# EAGLE design CPU-SOLDER_V2 (EAGLE 9.5.1)
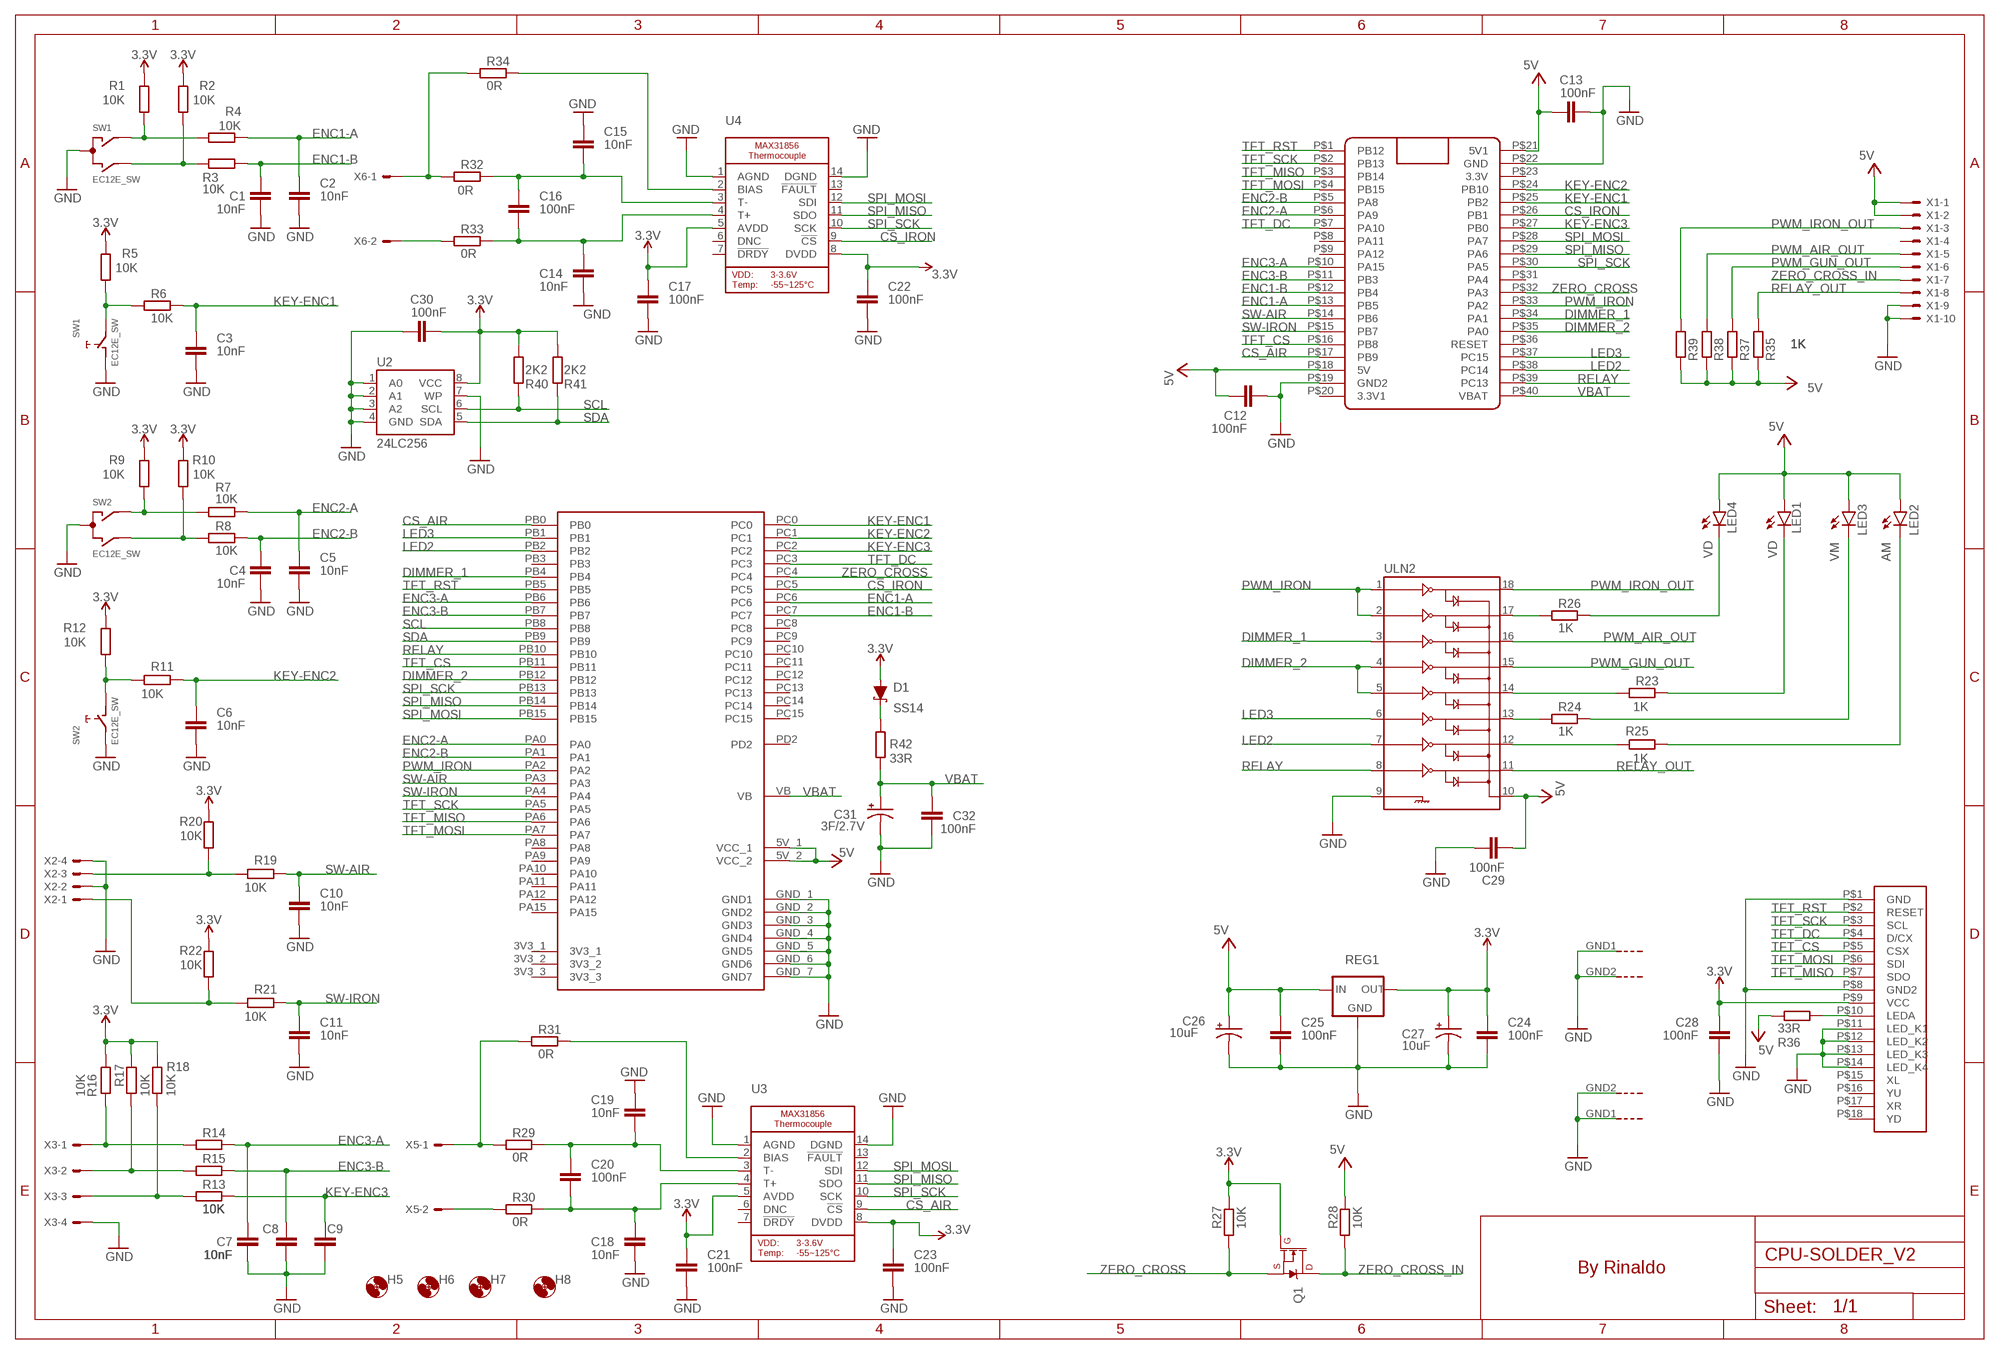
[diagram p0: schematic, sheet 1]

## Parts
C1  10nF  C-EUC0603  [C0603]
C2  10nF  C-EUC0603  [C0603]
C3  10nF  C-EUC0603  [C0603]
C4  10nF  C-EUC0603  [C0603]
C5  10nF  C-EUC0603  [C0603]
C6  10nF  C-EUC0603  [C0603]
C7  10nF  C-EUC0603  [C0603]
C8  10nF  C-EUC0603  [C0603]
C9  10nF  C-EUC0603  [C0603]
C10  10nF  C-EUC0603  [C0603]
C11  10nF  C-EUC0603  [C0603]
C12  100nF  C-EUC0603  [C0603]
C13  100nF  C-EUC0603  [C0603]
C14  10nF  C-EUC0603  [C0603]
C15  10nF  C-EUC0603  [C0603]
C16  100nF  C-EUC0603  [C0603]
C17  100nF  C-EUC0603  [C0603]
C18  10nF  C-EUC0603  [C0603]
C19  10nF  C-EUC0603  [C0603]
C20  100nF  C-EUC0603  [C0603]
C21  100nF  C-EUC0603  [C0603]
C22  100nF  C-EUC0603  [C0603]
C23  100nF  C-EUC0603  [C0603]
C24  100nF  C-EUC0603  [C0603]
C25  100nF  C-EUC0603  [C0603]
C26  10uF  10UF-POLAR-EIA3528-20V-10%(TANT)  [EIA3528]
C27  10uF  10UF-POLAR-EIA3528-20V-10%(TANT)  [EIA3528]
C28  100nF  C-EUC0603  [C0603]
C29  100nF  C-EUC0603  [C0603]
C30  100nF  C-EUC0603  [C0603]
C31  3F/2.7V  1F-2.7V(PTH)CPOL-RADIAL-1H-2.7V  [CPOL-RADIAL-1F-2.7V]
C32  100nF  C-EUC0603  [C0603]
D1  SS14  DIODE-SCHOTTKY-SS14  [SMA-DIODE]
H5  MOUNT-HOLE3.6  [3,6]
H6  MOUNT-HOLE3.6  [3,6]
H7  MOUNT-HOLE3.6  [3,6]
H8  MOUNT-HOLE3.6  [3,6]
LCD1  ILI9341-3.2  [ILI9341-3.2]
LED1  VD  LED5MM  [LED5MM]
LED2  AM  LED5MM  [LED5MM]
LED3  VM  LED5MM  [LED5MM]
LED4  VD  LED5MM  [LED5MM]
Q1  220mA/50V/3.5Ω  MOSFET-NCH-BSS138  [SOT23-3]
R1  10K  R-EU_R0603  [R0603]
R2  10K  R-EU_R0603  [R0603]
R3  10K  R-EU_R0603  [R0603]
R4  10K  R-EU_R0603  [R0603]
R5  10K  R-EU_R0603  [R0603]
R6  10K  R-EU_R0603  [R0603]
R7  10K  R-EU_R0603  [R0603]
R8  10K  R-EU_R0603  [R0603]
R9  10K  R-EU_R0603  [R0603]
R10  10K  R-EU_R0603  [R0603]
R11  10K  R-EU_R0603  [R0603]
R12  10K  R-EU_R0603  [R0603]
R13  10K  R-EU_R0603  [R0603]
R14  10K  R-EU_R0603  [R0603]
R15  10K  R-EU_R0603  [R0603]
R16  10K  R-EU_R0603  [R0603]
R17  10K  R-EU_R0603  [R0603]
R18  10K  R-EU_R0603  [R0603]
R19  10K  R-EU_R0603  [R0603]
R20  10K  R-EU_R0603  [R0603]
R21  10K  R-EU_R0603  [R0603]
R22  10K  R-EU_R0603  [R0603]
R23  1K  R-EU_R0603  [R0603]
R24  1K  R-EU_R0603  [R0603]
R25  1K  R-EU_R0603  [R0603]
R26  1K  R-EU_R0603  [R0603]
R27  10K  R-EU_R0603  [R0603]
R28  10K  R-EU_R0603  [R0603]
R29  0R  R-EU_R0603  [R0603]
R30  0R  R-EU_R0603  [R0603]
R31  0R  R-EU_R0603  [R0603]
R32  0R  R-EU_R0603  [R0603]
R33  0R  R-EU_R0603  [R0603]
R34  0R  R-EU_R0603  [R0603]
R35  1K  R-EU_R0603  [R0603]
R36  33R  R-EU_R2512  [R2512]
R37  1K  R-EU_R0603  [R0603]
R38  1K  R-EU_R0603  [R0603]
R39  1K  R-EU_R0603  [R0603]
R40  2K2  R-EU_R0603  [R0603]
R41  2K2  R-EU_R0603  [R0603]
R42  33R  R-EU_R2512  [R2512]
REG1  V_REG_LD1117VXXLD1117-SMD  [SOT223]
SW1  EC12E_SW  [ALPS_EC12E_SW]
SW2  EC12E_SW  [ALPS_EC12E_SW]
U1  STM32-F411  BLACK-PILL-STM32_BLACK_PILL  [BLACK-PILL-STM32_BLUE_PILL]
U2  24LC256  EEPROM-I2C256K  [SO08]
U3  MICROBUILDER_MAX31856  [MICROBUILDER_TSSOP14]
U4  MICROBUILDER_MAX31856  [MICROBUILDER_TSSOP14]
U5  F405_WEACT  [F405_WEACT]
ULN2  ULN2803SOICW  [SO18L]
X1  JST-XH-10-PIN-ROUND-PAD  [JST-XH-10-PACKAGE-ROUND-PAD]
X2  JST-XH-04-PIN-ROUND-PAD  [JST-XH-04-PACKAGE-ROUND-PAD]
X3  JST-XH-04-PIN-ROUND-PAD  [JST-XH-04-PACKAGE-ROUND-PAD]
X5  JST-XH-02-PIN-ROUND-PAD  [JST-XH-02-PACKAGE-ROUND-PAD]
X6  JST-XH-02-PIN-ROUND-PAD  [JST-XH-02-PACKAGE-ROUND-PAD]

## Nets
3.3V: C17.2 C21.2 C22.2 C23.2 C24.2 C27.A(+) C28.2 C30.1 D1.A LCD1.P$9(VCC) Q1.1(G) R1.2 R2.2 R5.2 R9.2 R10.2 R12.2 R16.2 R17.2 R18.2 R20.2 R22.2 R27.2 R40.1 R41.1 REG1.2(OUT) U2.8(VCC) U3.5(AVDD) U3.8(DVDD) U4.5(AVDD) U4.8(DVDD)
CS_AIR: U1.P$17(PB9) U3.9(!CS) U5.PB0
CS_IRON: U1.P$26(PB1) U4.9(!CS) U5.PC5
DIMMER_1: U1.P$34(PA1) U5.PB4 ULN2.3
DIMMER_2: U1.P$35(PA0) U5.PB12 ULN2.4 ULN2.5
ENC1-A: C2.1 R3.1 U1.P$13(PB5) U5.PC6
ENC1-B: C1.1 R4.2 U1.P$12(PB4) U5.PC7
ENC2-A: C5.1 R7.2 U1.P$6(PA9) U5.PA0
ENC2-B: C4.1 R8.2 U1.P$5(PA8) U5.PA1
ENC3-A: C7.1 R14.2 U1.P$10(PA15) U5.PB6
ENC3-B: C8.1 R15.2 U1.P$11(PB3) U5.PB7
GND: C1.2 C2.2 C3.2 C4.2 C5.2 C6.2 C7.2 C8.2 C9.2 C10.2 C11.2 C12.2 C13.2 C14.1 C15.2 C17.1 C18.1 C19.2 C21.1 C22.1 C23.1 C24.1 C25.1 C26.C(-) C27.C(-) C28.1 C29.2 C30.2 C31.- C32.2 LCD1.P$1(GND) LCD1.P$8(GND2) LCD1.P$11(LED_K1) LCD1.P$12(LED_K2) LCD1.P$13(LED_K3) LCD1.P$14(LED_K4) REG1.1(GND) SW1.C SW1.D SW1.GND1(G) SW1.GND2(G) SW2.C SW2.E SW2.GND1(G) SW2.GND2(G) U1.P$19(GND2) U1.P$22(GND) U2.1(A0) U2.2(A1) U2.3(A2) U2.4(GND) U2.7(WP) U3.1(AGND) U3.14(DGND) U4.1(AGND) U4.14(DGND) U5.GND_1(GND1) U5.GND_2(GND2) U5.GND_3(GND3) U5.GND_4(GND4) U5.GND_5(GND5) U5.GND_6(GND6) U5.GND_7(GND7) ULN2.9 X1.9 X1.10 X2.2 X2.4 X3.4
KEY-ENC1: C3.1 R6.1 U1.P$25(PB2) U5.PC0
KEY-ENC2: C6.1 R11.1 U1.P$24(PB10) U5.PC1
KEY-ENC3: C9.1 R13.2 U1.P$27(PB0) U5.PC2
LED2: U1.P$38(PC14) U5.PB2 ULN2.7
LED3: U1.P$37(PC15) U5.PB1 ULN2.6
N$1: R1.1 R3.2 SW1.A
N$2: R2.1 R4.1 SW1.B
N$3: R7.1 R9.1 SW2.A
N$4: R8.1 R10.1 SW2.B
N$5: R5.1 R6.2 SW1.E
N$6: R11.2 R12.1 SW2.D
N$7: R24.2 ULN2.13
N$8: R14.1 R16.1 X3.1
N$9: R15.1 R17.1 X3.2
N$10: R13.1 R18.1 X3.3
N$11: R25.1 ULN2.12
N$12: R23.2 ULN2.14
N$13: LED1.K(C) R23.1
N$14: R21.2 R22.1 X2.1
N$15: R19.2 R20.1 X2.3
N$16: LED3.K(C) R24.1
N$17: LED2.K(C) R25.2
N$18: R26.1 ULN2.17
N$19: LED4.K(C) R26.2
N$20: R29.2 R31.2 X5.1
N$21: R32.2 R34.2 X6.1
N$23: LCD1.P$10(LEDA) R36.2
N$24: D1.C R42.2
N$28: C15.1 C16.2 R32.1 U4.3(T-)
N$29: C14.2 C16.1 R33.1 U4.4(T+)
N$31: R33.2 X6.2
N$33: R34.1 U4.2(BIAS)
N$36: C19.1 C20.2 R29.1 U3.3(T-)
N$37: C18.2 C20.1 R30.1 U3.4(T+)
N$38: R30.2 X5.2
N$39: R31.1 U3.2(BIAS)
PWM_AIR_OUT: R38.1 ULN2.16 X1.5
PWM_GUN_OUT: R37.1 ULN2.15 X1.6
PWM_IRON: U1.P$33(PA2) U5.PA2 ULN2.1 ULN2.2
PWM_IRON_OUT: R39.1 ULN2.18 X1.3
RELAY: U1.P$39(PC13) U5.PB10 ULN2.8
RELAY_OUT: R35.1 ULN2.11 X1.8
SCL: R40.2 U2.6(SCL) U5.PB8
SDA: R41.2 U2.5(SDA) U5.PB9
SPI_MISO: U1.P$29(PA6) U3.11(SDO) U4.11(SDO) U5.PB14
SPI_MOSI: U1.P$28(PA7) U3.12(SDI) U4.12(SDI) U5.PB15
SPI_SCK: U1.P$30(PA5) U3.10(SCK) U4.10(SCK) U5.PB13
SW-AIR: C10.1 R19.1 U1.P$14(PB6) U5.PA3
SW-IRON: C11.1 R21.1 U1.P$15(PB7) U5.PA4
TFT_CS: LCD1.P$5(CSX) U1.P$16(PB8) U5.PB11
TFT_DC: LCD1.P$4(D/CX) U1.P$7(PA10) U5.PC3
TFT_MISO: LCD1.P$7(SDO) U1.P$3(PB14) U5.PA6
TFT_MOSI: LCD1.P$6(SDI) U1.P$4(PB15) U5.PA7
TFT_RST: LCD1.P$2(RESET) U1.P$1(PB12) U5.PB5
TFT_SCK: LCD1.P$3(SCL) U1.P$2(PB13) U5.PA5
VBAT: C31.+ C32.1 R42.1 U1.P$40(VBAT) U5.VB
VCC: C12.1 C13.1 C25.2 C26.A(+) C29.1 LED1.A LED2.A LED3.A LED4.A R28.2 R35.2 R36.1 R37.2 R38.2 R39.2 REG1.3(IN) U1.P$18(5V) U1.P$21(5V1) U5.5V_1(VCC_1) U5.5V_2(VCC_2) ULN2.10 X1.1 X1.2 ; supply symbol labelled 5V
ZERO_CROSS: Q1.2(S) R27.1 U1.P$32(PA3) U5.PC4
ZERO_CROSS_IN: Q1.3(D) R28.1 X1.7
Unconnected: LCD1.P$15(XL) LCD1.P$16(YU) LCD1.P$17(XR) LCD1.P$18(YD) U1.P$8(PA11) U1.P$9(PA12) U1.P$20(3.3V1) U1.P$23(3.3V) U1.P$31(PA4) U1.P$36(RESET) U3.6(DNC) U3.7(!DRDY) U3.13(!FAULT) U4.6(DNC) U4.7(!DRDY) U4.13(!FAULT) U5.3V3_1 U5.3V3_2 U5.3V3_3 U5.PA8 U5.PA9 U5.PA10 U5.PA11 U5.PA12 U5.PA15 U5.PB3 U5.PC8 U5.PC9 U5.PC10 U5.PC11 U5.PC12 U5.PC13 U5.PC14 U5.PC15 U5.PD2 X1.4

## Notes on the sheet
- By Rinaldo

## Library data of the parts
C1-C25 C28-C30 C32 = rcl:C-EU: CAPACITOR, European symbol; SPICEPREFIX: C
C26 C27 = SparkFun-Capacitors:10UF-POLAR: 10.0µF polarized capacitors A capacitor is a passive two-terminal electrical component used to store electrical energy temporarily in an electric field.; PROD_ID: CAP-08063
C31 = SparkFun-Capacitors:1F-2.7V(PTH): 1F 2.7V SuperCapacitor CAP-14696; PROD_ID: CAP-14696
D1 = SparkFun-DiscreteSemi:DIODE-SCHOTTKY: Schottky diode A Schottky diode is a semiconductor diode which has a low forward voltage drop and a very fast switching action.; PROD_ID: DIO-08053; VALUE: 1A/40V/500mV
H5-H8 = holes:MOUNT-HOLE: MOUNTING HOLE with drill center marker
LCD1 = ili9341:ILI9341-3.2
LED1-LED4 = led:LED: LED OSRAM: - CHIPLED LG R971, LG N971, LY N971, LG Q971, LY Q971, LO R971, LY R971 LH N974, LH R974 LS Q976, LO Q976, LY Q976 LO Q996 - Hyper CHIPLED LW Q18S LB Q993, LB Q99A, LB R99A - SideLED LS A670, LO A670, LY A670, LG A670, LP A670 LB A673, LV A673, LT A673, LW A673 LH A674 LY A675 LS A676, LA A676, LO A676, LY A676, LW A676 LS A679, LY A679, LG A679 - Hyper Micro SIDELED® LS Y876, LA Y876, LO Y876, LY Y876 LT Y87S - SmartLED LW L88C, LW L88S LB L89C, LB L89S, LG L890 LS L89K, LO L89K, LY L89K LS L896, LA L896, LO L896, LY L896 - TOPLED LS T670, LO T670, LY T670, LG T670, LP T670 LSG T670, LSP T670, LSY T670, LOP T670, LYG T670 LG T671, LOG T671, LSG T671 LB T673, LV T673, LT T673, LW T673 LH T674 LS T676, LA T676, LO T676, LY T676, LB T676, LH T676, LSB T676, LW T676 LB T67C, LV T67C, LT T67C, LS T67K, LO T67K, LY T67K, LW E67C LS E67B, LA E67B, LO E67B, LY E67B, LB E67C, LV E67C, LT E67C LW T67C LS T679, LY T679, LG T679 LS T770, LO T770, LY T770, LG T770, LP T770 LB T773, LV T773, LT T773, LW T773 LH T774 LS E675, LA E675, LY E675, LS T675 LS T776, LA T776, LO T776, LY T776, LB T776 LHGB T686 LT T68C, LB T68C - Hyper Mini TOPLED® LB M676 - Mini TOPLED Santana® LG M470 LS M47K, LO M47K, LY M47K Source: http://www.osram.convergy.de LUXEON: - LUMILED® LXK2-PW12-R00, LXK2-PW12-S00, LXK2-PW14-U00, LXK2-PW14-V00 LXK2-PM12-R00, LXK2-PM12-S00, LXK2-PM14-U00 LXK2-PE12-Q00, LXK2-PE12-R00, LXK2-PE12-S00, LXK2-PE14-T00, LXK2-PE14-U00 LXK2-PB12-K00, LXK2-PB12-L00, LXK2-PB12-M00, LXK2-PB14-N00, LXK2-PB14-P00, LXK2-PB14-Q00 LXK2-PR12-L00, LXK2-PR12-M00, LXK2-PR14-Q00, LXK2-PR14-R00 LXK2-PD12-Q00, LXK2-PD12-R00, LXK2-PD12-S00 LXK2-PH12-R00, LXK2-PH12-S00 LXK2-PL12-P00, LXK2-PL12-Q00, LXK2-PL12-R00 Source: www.luxeon.com KINGBRIGHT: KA-3528ASYC Source: www.kingbright.com
Q1 = SparkFun-DiscreteSemi:MOSFET-NCH: N-channel MOSFETs Voltage controlled devices that allow control of high current outputs. SparkFun Products: SparkFun OpenScale <https://www.sparkfun.com/products/13261> SparkFun Digital Sandbox <https://www.sparkfun.com/products/12651> SparkFun Monster Moto Shield <https://www.sparkfun.com/products/10182> SparkFun MOSFET Power Controller <https://www.sparkfun.com/products/11214>; PROD_ID: TRANS-00830
R1-R42 = rcl:R-EU_: RESISTOR, European symbol; SPICEPREFIX: R
REG1 = SparkFun-IC-Power:V_REG_LD1117VXX: LD1117VXX voltage regulator. We carry the 3.3V version (COM-00526) in TO-220 package.; PROD_ID: VREG-13917
SW1 SW2 = switch-alps:EC12E_SW: ALPS rotary Encoder EC12E series with switch; MPN: EC12E2424407; OC_FARNELL: 1520813; OC_NEWARK: 74M1068
U1 = Mini Black Pill grblHAL v1:BLACK-PILL-STM32_BLACK_PILL
U2 = SparkFun-IC-Memory:EEPROM-I2C: I2C EEPROMs, 24LC256 and others 24LC256 Series 256 kb I2C 2 Wire (32 k x 8 Bit) 2.5 V Serial EEPROM SMD - SOIC-8 Datasheet SparkFun Products SparkFun UDB5 - PIC UAV Development Board <https://www.sparkfun.com/products/11703> (GPS-11703); PROD_ID: IC-09714
U3 U4 = Adafruit MAX31856:MICROBUILDER_MAX31856: MAX31856 - Thermocouple Sensor ADC
U5 = WeACT:F405_WEACT: F405_WEACT
ULN2 = SparkFun-IC-Special-Function:ULN2803: Darlington Driver(IC-07959, low stock) ULN2803 Darlington array. 500mA max per channel, 8-channel package. Spark Fun Electronics SKU : COM-00312
X1 = Rembrandt Electronics - JST XH Connectors v1-0:JST-XH-10-PIN: JST XH Connector 2 Pin Wire to board connector. Pitch: 2,54 mm, (0.100") Number of pins: 10 Created by Rembrandt Electronics www.rembrandtelectronics.com
X2 X3 = Rembrandt Electronics - JST XH Connectors v1-0:JST-XH-04-PIN: JST XH Connector 2 Pin Wire to board connector. Pitch: 2,54 mm, (0.100") Number of pins: 4 Created by Rembrandt Electronics www.rembrandtelectronics.com
X5 X6 = Rembrandt Electronics - JST XH Connectors v1-0:JST-XH-02-PIN: JST XH Connector 2 Pin Wire to board connector. Pitch: 2,54 mm, (0.100") Number of pins: 2 Created by Rembrandt Electronics www.rembrandtelectronics.com

## Board
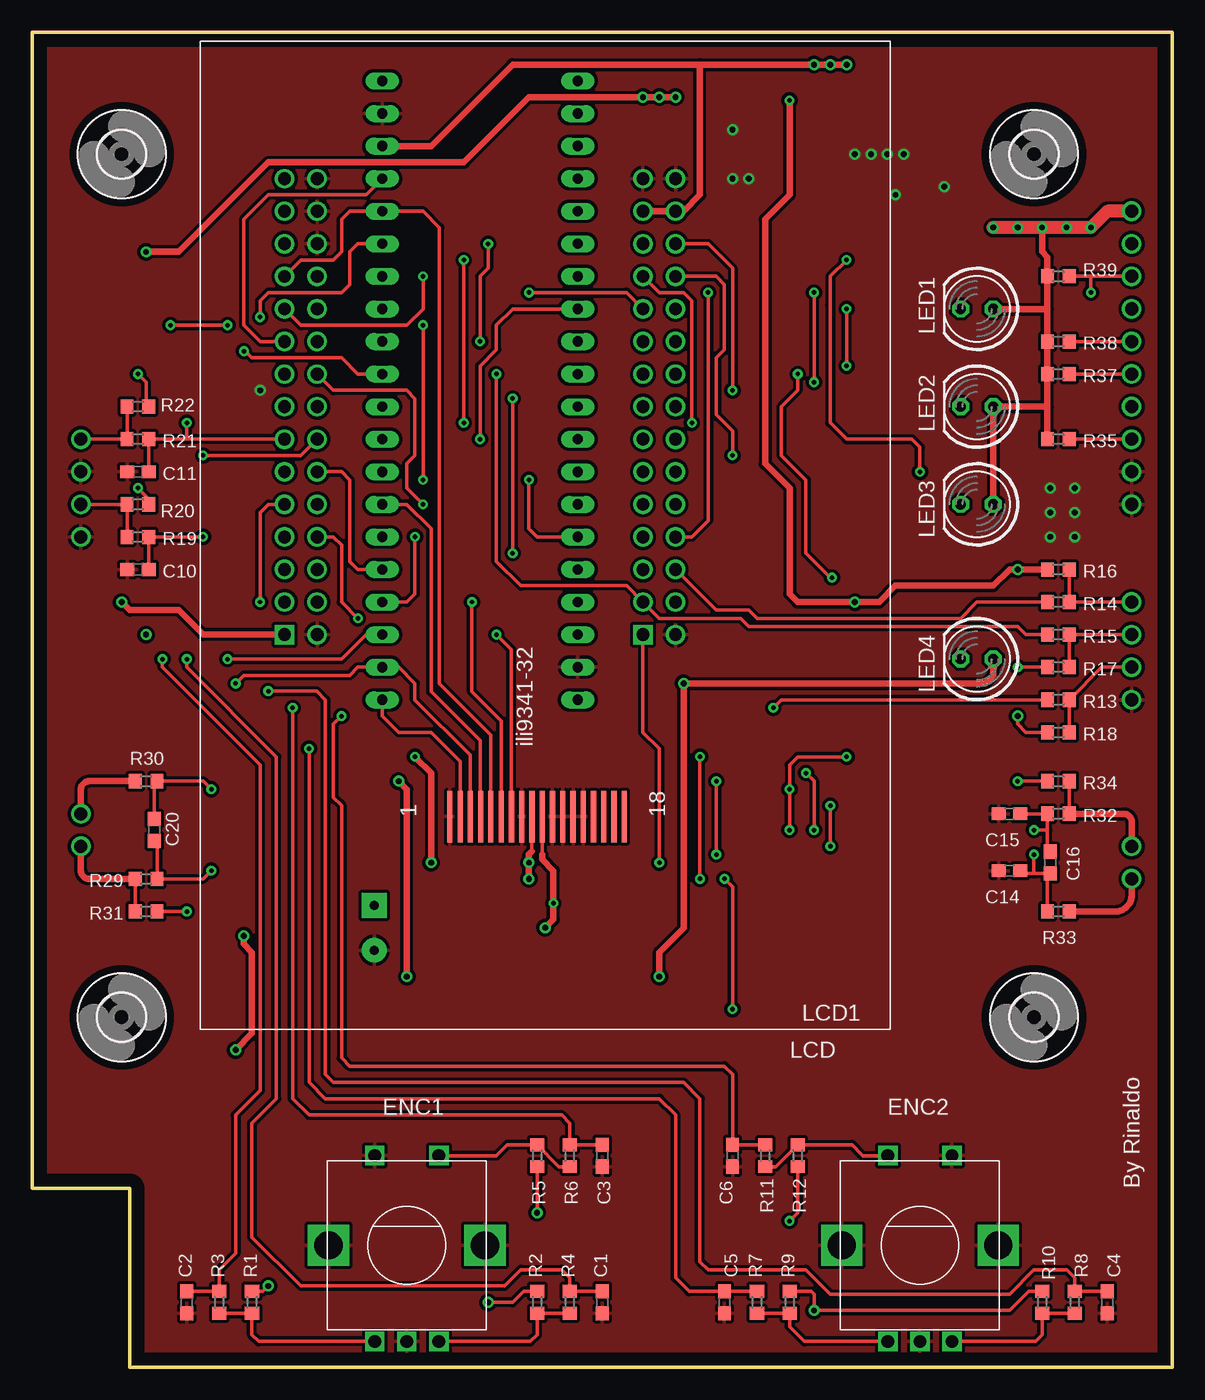
[diagram p1: board, top side]
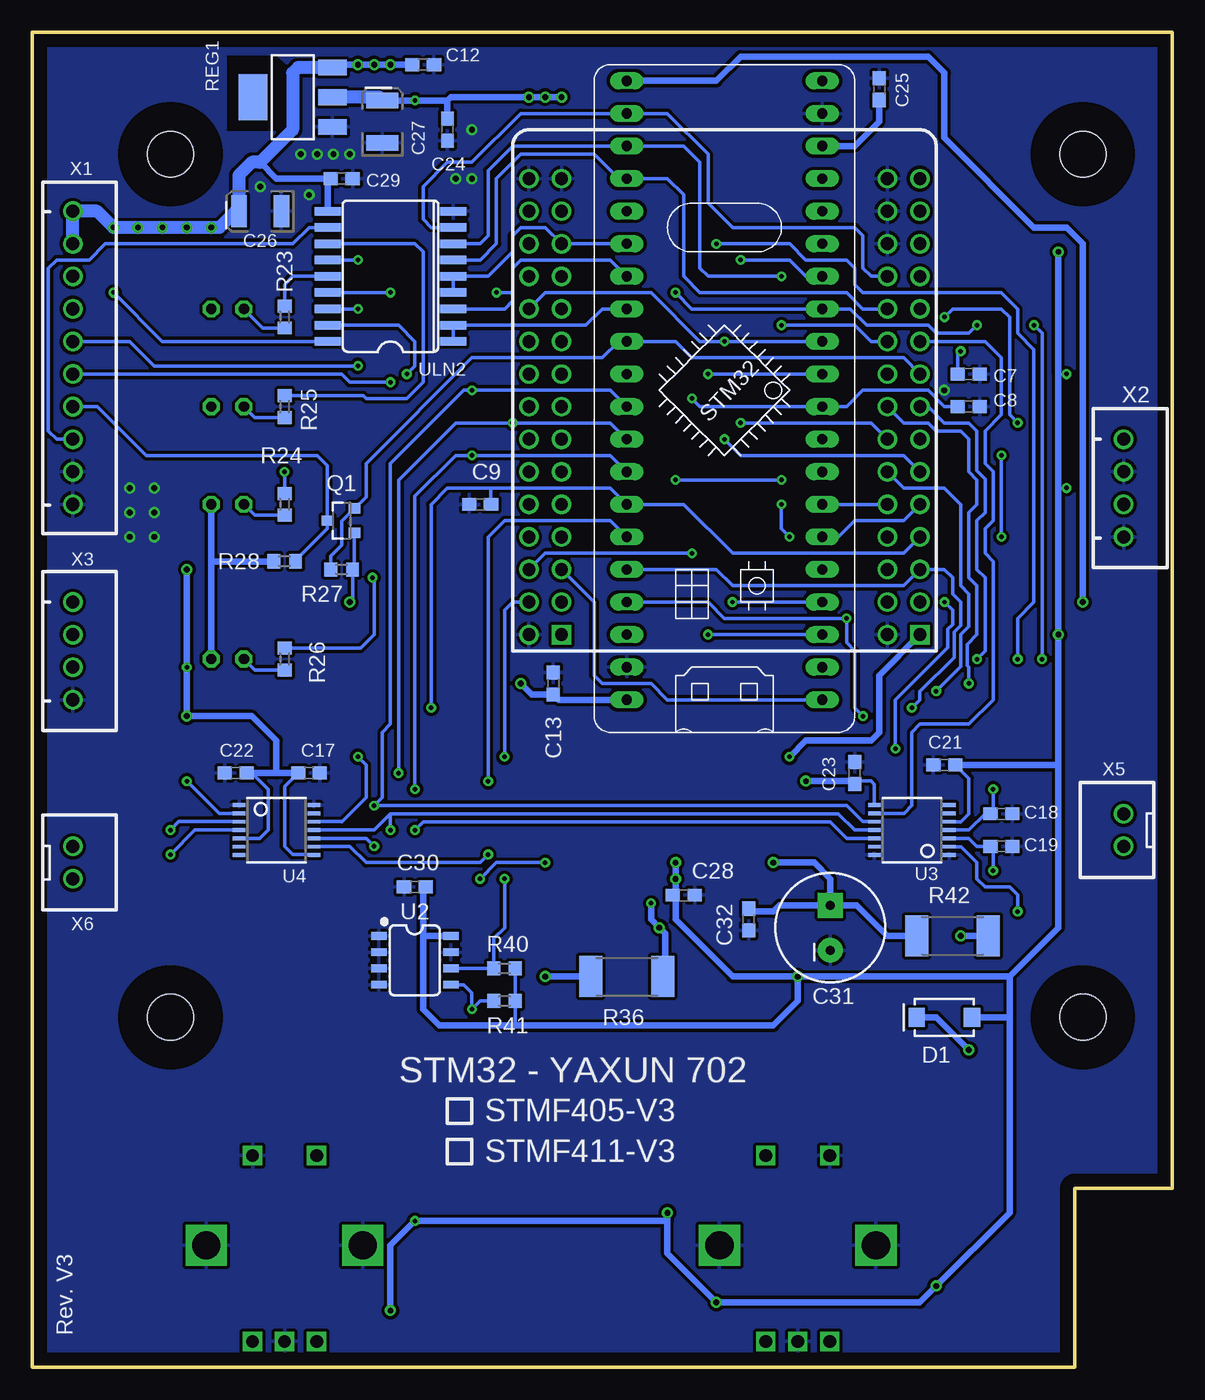
[diagram p2: board, bottom side, seen from below]

Size 88.9 x 104.14 mm. Coordinates in mm from the lower left corner, seen from the top.
Outline: 7.62,0 7.62,13.97 0,13.97 0,104.14 88.9,104.14 88.9,0 7.62,0
Copper layers (1*16): Top 0.035mm / dielectric 1.5mm / Bottom 0.035mm
Design rules "default *": minimum track width 10mil, minimum drill 0.35mm, track to track 10mil, track to pad 10mil, pad to pad 10mil, via to via 10mil, smd to smd 10mil, copper to edge 40mil, drill to drill 10mil, minimum pad ring 10mil, minimum via ring 8mil, stop-mask expansion 4mil, vias tented up to drill 0mil, thermal gap 10mil
bRestrict: 6 lines

### Footprints (pad centres in the part's own frame; a part is rotated, then mirrored left to right if it is on the bottom)
C0603 = smd 1.1 x 1: 1 -0.85,0; 2 0.85,0
EIA3528 = smd 1.2 x 2.5: A 1.65,0; C -1.65,0
CPOL-RADIAL-1F-2.7V = drill 0.7 pad 1.93 square: + 1.75,0 | drill 0.7 pad 1.93: - -1.75,0
SMA-DIODE = smd 1.27 x 1.47: A -2.15,0; C 2.15,0
3,6 = hole 3.6: 0,0
ILI9341-3.2 = smd 4 x 0.4: P$1 -18,6.8; P$2 -18,6; P$3 -18,5.2; P$4 -18,4.4; P$5 -18,3.6; P$6 -18,2.8; P$7 -18,2; P$8 -18,1.2; P$9 -18,0.4; P$10 -18,-0.4; P$11 -18,-1.2; P$12 -18,-2; P$13 -18,-2.8; P$14 -18,-3.6; P$15 -18,-4.4; P$16 -18,-5.2; P$17 -18,-6; P$18 -18,-6.8
LED5MM = drill 0.813 octagon: A -1.27,0; K 1.27,0
SOT23-3 = smd 0.8 x 0.9: 1 -0.95,-1; 2 0.95,-1; 3 0,1.1
R0603 = smd 1 x 1.1: 1 -0.85,0; 2 0.85,0
R2512 = smd 1.8 x 3.2: 1 -2.8,0; 2 2.8,0
SOT223 = smd 1.219 x 2.235: 1 -2.311,-3.099; 2 0,-3.099; 3 2.311,-3.099 | smd 3.6 x 2.2: 4 0,3.099
ALPS_EC12E_SW = drill 1 square: A -2.5,-7.5; B 2.5,-7.5; C 0,-7.5; D -2.5,7; E 2.5,7 | drill 2.2 square: GND1 -6.1,0; GND2 6.1,0
BLACK-PILL-STM32_BLUE_PILL = drill 0.8 long: P$1 -7.62,15.24; P$2 -7.62,12.7; P$3 -7.62,10.16; P$4 -7.62,7.62; P$5 -7.62,5.08; P$6 -7.62,2.54; P$7 -7.62,0; P$8 -7.62,-2.54; P$9 -7.62,-5.08; P$10 -7.62,-7.62; P$11 -7.62,-10.16; P$12 -7.62,-12.7; P$13 -7.62,-15.24; P$14 -7.62,-17.78; P$15 -7.62,-20.32; P$16 -7.62,-22.86; P$17 -7.62,-25.4; P$18 -7.62,-27.94; P$19 -7.62,-30.48; P$20 -7.62,-33.02; P$21 7.62,15.24; P$22 7.62,12.7; P$23 7.62,10.16; P$24 7.62,7.62; P$25 7.62,5.08; P$26 7.62,2.54; P$27 7.62,0; P$28 7.62,-2.54; P$29 7.62,-5.08; P$30 7.62,-7.62; P$31 7.62,-10.16; P$32 7.62,-12.7; P$33 7.62,-15.24; P$34 7.62,-17.78; P$35 7.62,-20.32; P$36 7.62,-22.86; P$37 7.62,-25.4; P$38 7.62,-27.94; P$39 7.62,-30.48; P$40 7.62,-33.02
SO08 = smd 0.6 x 1.2: 1 -1.905,-2.8; 2 -0.635,-2.8; 3 0.635,-2.8; 4 1.905,-2.8; 5 1.905,2.8; 6 0.635,2.8; 7 -0.635,2.8; 8 -1.905,2.8
MICROBUILDER_TSSOP14 = smd 0.305 x 0.991: 1 -1.95,-2.918; 2 -1.3,-2.918; 3 -0.65,-2.918; 4 0,-2.918; 5 0.65,-2.918; 6 1.3,-2.918; 7 1.95,-2.918; 8 1.95,2.918; 9 1.3,2.918; 10 0.65,2.918; 11 0,2.918; 12 -0.65,2.918; 13 -1.3,2.918; 14 -1.95,2.918
F405_WEACT = drill 1: 3V3_1 -7.62,-25.4; 3V3_2 -7.62,-27.94; 3V3_3 -7.62,-30.48; 5V_1 20.32,-27.94; 5V_2 22.86,-27.94; GND_1 -5.08,-25.4; GND_2 -5.08,-27.94; GND_3 -5.08,-30.48; GND_4 -5.08,5.08; GND_5 22.86,5.08; GND_6 20.32,-30.48; GND_7 22.86,-30.48; PA0 -7.62,-5.08; PA1 -5.08,-7.62; PA2 -7.62,-7.62; PA3 -5.08,-10.16; PA4 -7.62,-10.16; PA5 -5.08,-12.7; PA6 -7.62,-12.7; PA7 -5.08,-15.24; PA8 20.32,-15.24; PA9 22.86,-15.24; PA10 20.32,-12.7; PA11 22.86,-12.7; PA12 20.32,-10.16; PA15 22.86,-10.16; PB0 -7.62,-17.78; PB1 -5.08,-20.32; PB2 -7.62,-20.32; PB3 20.32,-2.54; PB4 22.86,-2.54; PB5 20.32,0; PB6 22.86,0; PB7 20.32,2.54; PB8 22.86,2.54; PB10 -5.08,-22.86; PB11 -7.62,-22.86; PB12 20.32,-25.4; PB13 22.86,-25.4; PB14 20.32,-22.86; PB15 22.86,-22.86; PC0 -7.62,0; PC1 -5.08,-2.54; PC2 -7.62,-2.54; PC3 -5.08,-5.08; PC4 -7.62,-15.24; PC5 -5.08,-17.78; PC6 20.32,-20.32; PC7 22.86,-20.32; PC8 20.32,-17.78; PC9 22.86,-17.78; PC10 20.32,-7.62; PC11 22.86,-7.62; PC12 20.32,-5.08; PC13 -5.08,2.54; PC14 -7.62,2.54; PC15 -5.08,0; PD2 22.86,-5.08 | drill 1 square: PB9 20.32,5.08; VB -7.62,5.08
SO18L = smd 0.66 x 2.032: 1 -0.635,-4.902; 2 0.635,-4.902; 3 1.905,-4.902; 4 3.175,-4.902; 5 4.445,-4.902; 6 5.715,-4.902; 7 6.985,-4.902; 8 8.255,-4.902; 9 9.525,-4.902; 10 9.525,4.902; 11 8.255,4.902; 12 6.985,4.902; 13 5.715,4.902; 14 4.445,4.902; 15 3.175,4.902; 16 1.905,4.902; 17 0.635,4.902; 18 -0.635,4.902
JST-XH-10-PACKAGE-ROUND-PAD = drill 1.016: 1 -11.43,0; 2 -8.89,0; 3 -6.35,0; 4 -3.81,0; 5 -1.27,0; 6 1.27,0; 7 3.81,0; 8 6.35,0; 9 8.89,0; 10 11.43,0
JST-XH-04-PACKAGE-ROUND-PAD = drill 1.016: 1 -3.81,0; 2 -1.27,0; 3 1.27,0; 4 3.81,0
JST-XH-02-PACKAGE-ROUND-PAD = drill 1.016: 1 -1.27,0; 2 1.27,0

### Placement (x,y rotation side)
C1  44.45,5.08 270 top
C2  12.06,5.08 270 top
C3  44.45,16.51 270 top
C4  83.82,5.08 270 top
C5  53.97,5.08 270 top
C6  54.61,16.51 270 top
C7  15.88,74.93 0 bottom
C8  15.88,77.47 0 bottom
C9  53.97,67.31 180 bottom
C10  8.26,62.23 180 top
C11  8.26,69.85 180 top
C12  58.42,101.6 0 bottom
C13  48.26,53.34 90 bottom
C14  76.2,38.73 0 top
C15  76.2,43.18 180 top
C16  79.38,39.37 90 top
C17  67.31,46.35 180 bottom
C18  13.34,43.18 180 bottom
C19  13.34,40.64 0 bottom
C20  9.53,41.91 270 top
C21  17.78,46.99 0 bottom
C22  73.03,46.35 0 bottom
C23  24.77,46.35 270 bottom
C24  56.52,96.52 90 bottom
C25  22.86,99.69 270 bottom
C26  71.12,90.17 180 bottom
C27  61.59,97.16 90 bottom
C28  38.1,36.83 180 bottom
C29  64.77,92.71 0 bottom
C30  59.06,37.46 180 bottom
C31  26.67,34.29 90 bottom
C32  33.02,34.92 270 bottom
D1  17.78,27.3 180 bottom
H5  6.99,94.61 0 top
H6  78.1,94.61 0 top
H7  6.99,27.3 0 top
H8  78.1,27.3 0 top
LCD1  39.37,60.96 90 top
LED1  73.66,82.55 180 top
LED2  73.66,74.93 180 top
LED3  73.66,67.31 180 top
LED4  73.66,55.25 180 top
Q1  64.77,66.04 90 bottom
R1  17.14,5.08 90 top
R2  39.37,5.08 90 top
R3  14.61,5.08 270 top
R4  41.91,5.08 90 top
R5  39.37,16.51 270 top
R6  41.91,16.51 270 top
R7  56.52,5.08 90 top
R8  81.28,5.08 90 top
R9  59.06,5.08 90 top
R10  78.74,5.08 90 top
R11  57.15,16.51 270 top
R12  59.69,16.51 270 top
R13  80.01,52.07 180 top
R14  80.01,59.69 180 top
R15  80.01,57.15 180 top
R16  80.01,62.23 180 top
R17  80.01,54.61 180 top
R18  80.01,49.53 180 top
R19  8.26,64.77 180 top
R20  8.26,67.31 0 top
R21  8.26,72.39 180 top
R22  8.26,74.93 0 top
R23  69.22,81.92 90 bottom
R24  69.22,67.31 90 bottom
R25  69.22,74.93 270 bottom
R26  69.22,55.25 270 bottom
R27  64.77,62.23 0 bottom
R28  69.22,62.86 180 bottom
R29  8.89,38.1 180 top
R30  8.89,45.72 180 top
R31  8.89,35.56 180 top
R32  80.01,43.18 0 top
R33  80.01,35.56 0 top
R34  80.01,45.72 0 top
R35  80.01,72.39 180 top
R36  42.55,30.48 0 bottom
R37  80.01,77.47 180 top
R38  80.01,80.01 180 top
R39  80.01,85.09 180 top
R40  52.07,31.12 180 bottom
R41  52.07,28.58 180 bottom
R42  17.14,33.66 0 bottom
REG1  68.58,99.06 90 bottom
SW1  29.21,9.52 0 top
SW2  69.22,9.52 0 top
U1  34.92,67.31 180 bottom
U2  59.06,31.75 270 bottom
U3  20.32,41.91 90 bottom
U4  69.85,41.91 270 bottom
U5  27.3,62.23 180 bottom
ULN2  60.96,80.64 90 bottom
X1  85.72,78.74 270 bottom
X2  3.81,68.58 270 bottom
X3  85.72,55.88 270 bottom
X5  3.81,41.91 90 bottom
X6  85.72,39.37 270 bottom

### Tracks (layer width: path | path; a pad name or v marks a point on that pad's centre or on a via)
3.3V  (via drill 0.35, 0.45)
  Top 0.254: 38.97,40.24 LCD1.P$9 | v76.83,50.8 76.83,50.16 77.47,49.53 R18.2 | R17.2 v76.83,54.61 | R9.2 60.75,5.93 60.96,5.71 v60.96,4.45 76.2,4.45 77.69,5.93 R10.2 | R12.2 59.69,12.06 v59.06,11.43 | R22.2 8.89,75.14 8.89,76.83 v8.26,77.47 | R20.2 9.11,67.73 v8.26,68.58 | R1.2 18,5.93 v18.41,6.35 | R5.2 v39.37,12.06 | R2.2 38.31,5.93 37.47,5.08 v35.56,5.08
  Top 0.508: 38.97,40.24 38.73,40.01 v38.73,39.37 v38.73,38.1 | v59.06,98.8 59.06,91.44 57.15,89.53 57.15,70.48 59.06,68.58 59.06,60.33 59.69,59.69 v64.14,59.69 66.04,59.69 67.31,60.96 74.93,60.96 76.2,62.23 v76.83,62.23 R16.2 | v29.21,30.48 29.21,45.09 v28.57,45.72 | v8.89,87 11.43,87 18.41,93.98 33.66,93.98 38.73,99.06 v48.89,99.06 v50.17,99.06
  Bottom 0.254: Q1.1 63.77,62.38 R27.2 63.92,59.91 v64.14,59.69 | U4.5 71.14,41.26 70.48,41.91 70.48,45.09 71.75,46.35 C22.2 | v8.26,77.47 8.89,77.47 | v8.26,68.58 8.89,68.58 | R40.1 R41.1 51.22,26.67 50.8,26.67 | U3.5 17.4,42.55 16.51,42.55 15.88,43.18 15.88,45.94 C21.2 | U3.8 23.24,45.46 23.5,45.72 24.55,45.72 C23.2 | U4.8 66.98,40.01 68.58,40.01 69.22,40.64 69.22,45.3 C17.2
  Bottom 0.508: v38.73,39.37 v38.73,38.1 38.73,37.05 C28.2 38.73,36.62 38.73,34.92 34.29,30.48 v29.21,30.48 | v76.83,62.23 v76.83,54.61 v76.83,50.8 71.75,50.8 69.85,48.89 69.85,46.35 | 8.89,46.99 v8.89,57.15 8.89,68.58 8.89,77.47 v8.89,87 | 8.89,46.99 8.89,34.29 12.7,30.48 | C21.2 8.89,46.99 | 12.7,30.48 12.7,27.3 | 12.7,27.3 12.7,12.06 v18.41,6.35 19.69,5.08 v35.56,5.08 39.37,8.89 39.37,11.43 | v29.21,30.48 12.7,30.48 | C27.A v59.06,98.8 56.52,98.8 | C24.2 56.52,98.8 | v29.21,30.48 29.21,28.58 31.11,26.67 50.8,26.67 57.15,26.67 58.42,27.94 58.42,33.66 | C30.1 58.42,37.25 58.42,33.66 | U2.8 58.42,33.66 | C23.2 24.98,45.72 v28.57,45.72 | 39.37,11.43 v39.37,12.06 | 39.37,11.43 v59.06,11.43 60.96,9.52 v60.96,4.45 | D1.A 12.7,27.3 | 56.52,98.8 56.26,99.06 v48.89,99.06 v47.62,99.06 | C17.2 69.85,46.35 | 69.85,46.35 C22.2
  Bottom 1.016: C27.A 61.85,99.06 REG1.2
CS_AIR
  Top 0.254: U1.P$17 26.04,91.44 18.41,91.44 16.51,89.53 16.51,81.28 17.78,80.01 U5.PB0
  Bottom 0.254: U3.9 20.93,43.21 20.32,43.81 20.32,49.53 19.69,50.16 15.88,50.16 13.97,52.07 13.97,62.86 14.61,63.5 14.61,65.41 13.97,66.04 13.97,69.85 14.61,70.48 14.61,73.03 13.34,74.3 13.34,78.74 14.61,80.01 U5.PB0
CS_IRON  (via drill 0.35)
  Top 0.254: v53.34,45.72 v53.34,40.01 | v30.48,81.28 v30.48,69.22 | v38.73,69.22 38.73,65.41 39.37,64.77 U1.P$26
  Bottom 0.254: v53.34,40.01 53.97,39.37 62.86,39.37 64.14,40.64 66.9,40.64 U4.9 | v30.48,69.22 v38.73,69.22 | U1.P$26 43.81,66.04 52.07,66.04 53.34,64.77 v53.34,45.72 | U5.PC5 23.5,80.01 24.77,81.28 v30.48,81.28
DIMMER_1  (via drill 0.35)
  Top 0.254: v52.7,83.82 52.7,66.04 51.44,64.77 U5.PB4
  Bottom 0.254: U1.P$34 43.81,86.36 50.8,86.36 51.44,85.72 51.44,83.82 | ULN2.3 52.07,82.55 51.44,83.19 51.44,83.82 | v52.7,83.82 51.44,83.82
DIMMER_2
  Bottom 0.254: ULN2.4 ULN2.5 53.34,85.09 51.44,87 51.44,88.27 50.8,88.9 48.89,88.9 U5.PB12 U1.P$35
ENC1-A  (via drill 0.35)
  Top 0.254: C2.1 R3.1 14.61,7.62 15.88,8.89 15.88,19.68 17.78,21.59 17.78,46.99 10.16,54.61 v10.16,55.25 | v38.73,83.82 46.36,83.82 U5.PC6 | v10.79,81.28 v15.24,81.28
  Bottom 0.254: v38.73,83.82 37.47,82.55 U1.P$13 25.1,82.55 23.83,81.28 19.05,81.28 18.41,80.64 15.88,80.64 v15.24,81.28 | v10.79,81.28 10.16,80.64 v10.16,55.25
ENC1-B  (via drill 0.35)
  Top 0.254: v35.56,87.63 35.56,85.72 34.92,85.09 v34.92,80.01 | v12.06,55.25 12.06,54.61 19.05,47.62 19.05,20.95 17.14,19.05 17.14,10.16 20.95,6.35 36.83,6.35 38.1,7.62 41.27,7.62 41.91,6.98 R4.2 C1.1
  Bottom 0.254: U1.P$12 v34.92,80.01 36.83,80.01 40.64,83.82 48.89,83.82 U5.PC7 | v35.56,87.63 29.84,87.63 28.57,86.36 25.4,86.36 24.77,85.72 24.77,84.45 24.13,83.82 13.34,83.82 12.06,82.55 12.06,80.64 10.79,79.38 10.79,59.69 12.06,58.42 v12.06,55.25
ENC2-A  (via drill 0.35)
  Top 0.254: R7.2 C5.1 51.22,5.93 50.17,6.98 50.17,19.68 48.89,20.95 22.86,20.95 21.59,22.22 v21.59,48.26 | U5.PA0 18.41,67.31 17.78,66.67 v17.78,59.69
  Bottom 0.254: U1.P$6 26.04,64.77 24.77,66.04 20.95,66.04 U5.PA0 | v21.59,48.26 21.59,52.07 17.53,56.13 17.53,57.57 17.14,57.95 17.14,59.05 v17.78,59.69
ENC2-B  (via drill 0.35)
  Top 0.254: U5.PA1 24.13,69.85 24.77,69.22 24.77,62.86 25.4,62.23 U1.P$5 | v18.41,52.75 22.18,52.75 22.86,52.07 22.86,22.86 23.5,22.22 50.8,22.22 52.07,20.95 52.07,8.25 52.7,7.62 60.33,7.62 62.23,5.71 76.2,5.71 78.1,7.62 80.64,7.62 81.28,6.98 R8.2 C4.1
  Bottom 0.254: v18.41,52.75 16.51,54.65 16.51,57.15 15.88,57.78 15.88,60.33 16.51,60.96 16.51,67.31 17.78,68.58 20.95,68.58 U5.PA1
ENC3-A  (via drill 0.35)
  Top 0.254: R14.2 73.66,59.69 72.39,58.42 56.52,58.42 55.88,59.05 53.34,59.05 U5.PB6 | v37.47,75.56 v37.47,63.5
  Bottom 0.254: U5.PB6 48.89,63.5 v37.47,63.5 | v37.47,75.56 36.83,74.93 U1.P$10 25.4,74.93 24.13,76.2 19.05,76.2 17.78,74.93 C7.1
ENC3-B  (via drill 0.35)
  Top 0.254: R15.2 77.47,57.15 76.83,57.78 55.88,57.78 55.25,58.42 48.89,58.42 U5.PB7 46.36,60.96 38.1,60.96 36.2,62.86 v36.2,77.47 | U1.P$11 25.4,77.47 24.13,78.74 17.14,78.74 16.51,79.38 v16.51,79.25
  Bottom 0.254: U1.P$11 v36.2,77.47 | v16.51,79.25 16.73,79.04 C8.1
GND  (via drill 0.45)
  other vias: 67.31,91.44 71.12,92.08 54.61,92.71 55.88,92.71 54.61,96.52 65.41,94.61 66.67,94.61 67.94,94.61 64.14,94.61 79.38,68.58 79.38,66.67 81.28,68.58 81.28,66.67 79.38,64.77 81.28,64.77 17.78,76.2
  pour Bottom: 0,104.14 88.9,104.14 88.9,0 7.62,0 7.62,13.97 0,13.97
  pour Top: 0,104.14 88.9,104.14 88.9,0 7.62,0 7.62,13.97 0,13.97
KEY-ENC1  (via drill 0.35)
  Top 0.254: v20.32,51.44 20.32,20.95 21.59,19.68 41.27,19.68 41.91,19.05 R6.1 C3.1
  Bottom 0.254: U1.P$25 35.56,62.23 34.29,60.96 20.95,60.96 U5.PC0 17.78,62.23 17.14,61.59 17.14,60.33 16.51,59.69 16.51,57.87 17.02,57.36 17.02,55.37 19.69,52.7 19.69,52.07 v20.32,51.44
KEY-ENC2  (via drill 0.35)
  Top 0.254: R11.1 C6.1 54.61,22.86 53.97,23.49 24.77,23.49 24.13,24.13 24.13,43.81 23.5,44.45 23.5,50.16 v24.13,50.8 | U5.PC1 23.5,64.77 24.13,64.14 24.13,59.69 v25.4,58.42
  Bottom 0.254: U1.P$24 36.2,59.69 34.92,58.42 v25.4,58.42 25.4,56.52 24.77,55.88 24.77,51.44 v24.13,50.8
KEY-ENC3  (via drill 0.35)
  Top 0.254: v57.78,51.44 58.42,52.07 R13.2
  Bottom 0.254: 53.12,68.58 43.81,68.58 U1.P$27 38.1,67.31 34.29,63.5 20.95,63.5 U5.PC2 | 53.12,68.58 56.52,68.58 57.78,67.31 v57.78,51.44 | C9.1 53.12,68.58
LED2  (via drill 0.35)
  Top 0.254: v30.48,85.09 30.48,82.55 29.21,81.28 20.95,81.28 U5.PB2
  Bottom 0.254: ULN2.7 53.97,87.63 53.34,88.27 53.34,93.34 51.44,95.25 U1.P$38 38.1,95.25 36.83,93.98 36.83,85.72 36.2,85.09 v30.48,85.09
LED3
  Bottom 0.254: ULN2.6 53.97,86.36 52.7,87.63 52.7,92.71 50.8,94.61 45.08,94.61 43.18,92.71 U1.P$37 39.37,92.71 38.1,91.44 38.1,85.09 36.83,83.82 25.4,83.82 24.13,82.55 U5.PB1
N$1
  Top 0.254: R3.2 R1.1 17.14,2.54 17.66,2.02 SW1.A
N$2
  Top 0.254: SW1.B 38.86,2.02 39.37,2.54 R2.1 R4.1
N$3
  Top 0.254: R7.1 R9.1 59.06,3.17 60.2,2.02 SW2.A
N$4
  Top 0.254: SW2.B 78.22,2.02 78.74,2.54 R10.1 R8.1
N$5
  Top 0.254: SW1.E 31.73,16.51 36.2,16.51 37.05,17.36 R5.1 41.07,15.66 R6.2
N$6
  Top 0.254: R11.2 57.99,15.66 R12.1 63.92,17.36 64.77,16.51 SW2.D
N$7  (via drill 0.35)
  Top 0.254: v69.22,69.85 69.22,71.75 68.58,72.39 63.5,72.39 62.21,73.68 62.21,82.82 62.23,82.84 62.23,85.09 v63.5,86.36
  Bottom 0.254: R24.2 v69.22,69.85 | ULN2.13 v63.5,86.36
N$8
  Top 0.254: X3.1 R14.1 R16.1
N$9
  Top 0.254: X3.2 R15.1 R17.1
N$10
  Top 0.254: X3.3 83.4,54.61 R13.1 R18.1
N$11
  Bottom 0.254: R25.1 63.08,75.78 62.86,75.56 59.69,75.56 58.42,76.83 58.42,87 59.06,87.63 ULN2.12
N$12
  Bottom 0.254: ULN2.14 68.58,85.09 69.22,84.45 R23.2
N$13
  Bottom 0.254: LED1.K 70.91,81.06 R23.1
N$14
  Top 0.254: X2.1 R21.2 R22.1
N$15
  Top 0.254: X2.3 R20.1 R19.2
N$16
  Bottom 0.254: LED3.K 71.54,66.46 R24.1
N$17
  Bottom 0.254: R25.2 71.54,74.08 LED2.K
N$18  (via drill 0.35)
  Top 0.254: v59.69,77.47 59.69,76.2 58.42,74.93 58.42,71.12 60.33,69.22 60.33,63.5 62.23,61.59 v62.35,61.59
  Bottom 0.254: v59.69,77.47 59.06,78.11 59.06,80.01 60.33,81.28 ULN2.17 | R26.1 63.28,56.09 62.23,57.15 62.23,61.47 v62.35,61.59
N$19
  Bottom 0.254: R26.2 71.54,54.39 LED4.K
N$20
  Top 0.254: R31.2 R29.2
  Top 0.508: R29.2 4.45,38.1 arc-90 3.81,38.73 X5.1
N$21
  Top 0.254: R32.2 R34.2
  Top 0.508: R32.2 85.09,43.18 arc-90 85.72,42.55 X6.1
N$23  (via drill 0.35, 0.45)
  Top 0.254: 39.77,40.01 LCD1.P$10
  Top 0.508: 39.77,40.01 39.77,39.6 40.64,38.73 v40.64,36.2 40.64,34.92 v40,34.29
  Bottom 0.254: 39.56,30.67 R36.2
  Bottom 0.508: 39.56,30.67 39.56,33.84 v40,34.29 40.64,34.92 v40.64,36.2
N$24  (via drill 0.45)
  Top 0.508: v16.51,33.66 16.51,33.02 17.14,32.38 17.14,26.03 v15.88,24.77
  Bottom 0.508: R42.2 v16.51,33.66 | D1.C 18.41,27.3 v15.88,24.77
N$28  (via drill 0.35)
  Top 0.254: C16.2 arc-90 79.16,40.44 79.16,41.91 | 79.16,41.91 R32.1 C15.1 | v78.1,41.91 79.16,41.91
  Bottom 0.254: U4.3 77.45,42.56 v78.1,41.91
N$29  (via drill 0.35)
  Top 0.254: R33.1 79.16,38.3 C16.1 78.1,38.52 | 78.1,38.52 77.27,38.52 C14.2 | v78.1,40.01 78.1,38.52
  Bottom 0.254: U4.4 76.2,41.91 v78.1,40.01
N$31
  Top 0.508: R33.2 84.45,35.56 arc90 85.72,36.83 X6.2
N$33  (via drill 0.35)
  Top 0.254: v76.83,45.72 R34.1
  Bottom 0.254: v76.83,45.72 74.33,43.21 U4.2
N$36  (via drill 0.35)
  Top 0.254: C20.2 9.74,40.84 R29.1 13.34,38.1 v13.97,38.73
  Bottom 0.254: v13.97,38.73 13.97,40.42 C19.1 15.24,40.64 15.86,41.26 U3.3
N$37  (via drill 0.35)
  Top 0.254: C20.1 9.53,45.51 R30.1 13.34,45.72 v13.97,45.09
  Bottom 0.254: v13.97,45.09 13.97,43.39 C18.2 14.61,43.18 15.88,41.91 U3.4
N$38
  Top 0.508: R30.2 4.45,45.72 arc90 3.81,45.09 X5.2
N$39  (via drill 0.35)
  Top 0.254: v12.06,35.56 R31.1
  Bottom 0.254: U3.2 16.48,40.61 15.24,39.37 15.24,38.1 14.61,37.46 12.7,37.46 12.06,36.83 v12.06,35.56
PWM_AIR_OUT  (via drill 0.35)
  Top 0.254: R38.1 X1.5 | v63.5,78.11 v63.5,82.55
  Bottom 0.254: v63.5,82.55 ULN2.16 | X1.5 81.28,80.01 79.38,78.11 v63.5,78.11
PWM_GUN_OUT  (via drill 0.35)
  Top 0.254: R37.1 X1.6 | v60.96,76.83 v60.96,83.82
  Bottom 0.254: v60.96,76.83 64.14,76.83 64.77,77.47 X1.6 | v60.96,83.82 ULN2.15
PWM_IRON  (via drill 0.35)
  Top 0.254: v34.92,72.39 34.92,78.11 36.2,79.38 36.2,81.28 37.47,82.55 U1.P$33
  Bottom 0.254: v34.92,72.39 33.66,71.12 20.95,71.12 U5.PA2 | ULN2.1 ULN2.2 45.72,81.28 44.45,82.55 U1.P$33
PWM_IRON_OUT  (via drill 0.35)
  Top 0.254: R39.1 82.55,85.09 | 82.55,85.09 X1.3 | v82.55,83.82 82.55,85.09
  Bottom 0.254: v82.55,83.82 78.74,80.01 ULN2.18
RELAY
  Bottom 0.254: ULN2.8 57.78,88.9 58.42,89.53 58.42,92.08 56.52,93.98 54.61,93.98 50.8,97.79 U1.P$39 39.37,97.79 36.2,94.61 36.2,90.8 34.29,88.9 24.77,88.9 24.13,88.27 24.13,85.72 23.5,85.09 U5.PB10
RELAY_OUT
  Top 0.254: X1.8 R35.1
  Bottom 0.254: X1.8 86.99,72.39 87.63,73.03 87.63,85.72 86.99,86.36 84.45,86.36 83.19,87.63 68.58,87.63 67.31,88.9 ULN2.11
SCL  (via drill 0.35)
  Top 0.254: v52.07,47.62 v52.07,38.1
  Bottom 0.254: U5.PB8 51.44,59.69 52.07,59.05 v52.07,47.62 | U2.6 R40.2 52.92,33.44 52.07,34.29 v52.07,38.1
SDA  (via drill 0.35)
  Top 0.254: U5.PB9 47.62,49.53 48.89,48.26 v48.89,39.37 | v53.97,38.1 54.61,37.46 v54.61,27.94
  Bottom 0.254: v53.97,38.1 52.7,39.37 v48.89,39.37 | R41.2 53.97,28.58 v54.61,27.94 54.61,29.21 55.25,29.84 U2.5
SPI_MISO  (via drill 0.35)
  Top 0.254: v60.33,46.35 60.96,45.72 v60.96,41.91 | U5.PB14 48.89,83.82 50.8,83.82 51.44,83.19 v51.44,73.66
  Bottom 0.254: v60.33,46.35 60.33,69.22 55.88,73.66 v51.44,73.66 43.81,73.66 U1.P$29 | 60.96,43.18 62.23,41.91 U4.11 | v60.96,41.91 60.96,43.18 | U3.11 24.77,41.91 26.04,43.18 60.96,43.18
SPI_MOSI  (via drill 0.35)
  Top 0.254: v59.06,41.91 v59.06,45.09 59.06,46.99 59.69,47.62 v63.5,47.62 | U5.PB15 53.34,85.09 53.97,84.45 53.97,79.38 53.34,78.74 53.34,74.3 54.61,73.03 v54.61,71.12
  Bottom 0.254: U4.12 64.78,42.56 64.77,42.55 62.86,44.45 62.86,46.99 v63.5,47.62 | v59.06,45.09 59.06,67.94 55.88,71.12 v54.61,71.12 43.81,71.12 U1.P$28 | v59.06,41.91 58.42,42.55 26.67,42.55 25.38,41.26 U3.12
SPI_SCK  (via drill 0.35)
  Top 0.254: v62.23,40.64 v62.23,43.81 | U5.PB13 52.7,87.63 54.61,85.72 v54.61,76.2
  Bottom 0.254: U4.10 62.85,41.26 v62.23,40.64 | U3.10 24.14,42.56 25.4,43.81 v62.23,43.81 61.59,44.45 61.59,49.53 60.96,50.16 60.96,70.48 55.25,76.2 v54.61,76.2 43.81,76.2 U1.P$30
SW-AIR  (via drill 0.35)
  Top 0.254: C10.1 R19.1 v13.34,64.77 | v33.66,73.66 v33.66,86.36 | U5.PA3 20.95,71.12 v13.34,71.12
  Bottom 0.254: v13.34,64.77 v13.34,71.12 | v33.66,86.36 29.84,86.36 28.57,85.09 U1.P$14 | U5.PA3 23.5,73.66 v33.66,73.66
SW-IRON  (via drill 0.35)
  Top 0.254: C11.1 R21.1 12.06,72.39 | U5.PA4 12.06,72.39 | v12.06,73.66 12.06,72.39 | U1.P$15 25.4,87.63 24.77,87 24.77,84.45 24.13,83.82 18.41,83.82 17.78,83.19 v17.78,81.92
  Bottom 0.254: v12.06,73.66 12.7,74.3 12.7,81.92 13.34,82.55 17.14,82.55 v17.78,81.92
TFT_CS
  Top 0.254: LCD1.P$5 35.77,49.32 31.75,53.34 31.75,88.9 30.48,90.17 U1.P$16 24.77,90.17 24.13,89.53 24.13,87 23.5,86.36 20.95,86.36 U5.PB11
TFT_DC
  Top 0.254: U1.P$7 29.21,67.31 31.11,65.41 31.11,52.7 34.92,48.89 34.92,43.01 LCD1.P$4
  Bottom 0.254: U5.PC3 U1.P$7
TFT_MISO  (via drill 0.35)
  Top 0.254: LCD1.P$7 37.37,55.97 v36.2,57.15 | U1.P$3 26.04,57.15 24.13,55.25 v15.24,55.25
  Bottom 0.254: v36.2,57.15 U1.P$3 | v15.24,55.25 14.61,55.88 14.61,61.59 15.24,62.23 15.24,66.04 14.61,66.67 14.61,69.3 15.24,69.93 15.24,73.03 15.88,73.66 17.78,73.66 19.05,74.93 U5.PA6
TFT_MOSI  (via drill 0.35)
  Top 0.254: LCD1.P$6 36.57,50.42 34.29,52.7 v34.29,59.69 | v30.48,67.31 29.21,68.58 29.21,70.48 29.84,71.12 29.84,75.56 29.21,76.2 23.5,76.2 U5.PA7 | U1.P$4 29.21,59.69 29.84,60.33 v29.84,64.77
  Bottom 0.254: v34.29,59.69 U1.P$4 | v30.48,67.31 30.48,65.41 v29.84,64.77
TFT_RST
  Top 0.254: LCD1.P$2 33.37,47.27 31.11,49.53 28.57,49.53 27.3,50.8 U1.P$1
  Bottom 0.254: U5.PB5 45.08,59.69 45.08,53.98 44.45,53.34 40.64,53.34 39.37,52.07 U1.P$1
TFT_SCK  (via drill 0.35)
  Top 0.254: LCD1.P$3 34.17,47.74 29.84,52.07 29.84,53.34 28.57,54.61 U1.P$2 25.4,54.61 24.77,53.98 16.51,53.98 v15.88,53.34
  Bottom 0.254: U5.PA5 20.95,73.66 19.05,73.66 18.41,73.03 16.51,73.03 15.88,72.39 15.88,69.85 15.24,69.22 15.24,67.31 15.88,66.67 15.88,61.59 15.24,60.96 15.24,57.15 16,56.39 16,54.73 15.88,54.61 v15.88,53.34
VBAT  (via drill 0.35, 0.45)
  Top 0.508: v29.84,47.62 31.11,46.35 v31.11,39.37 | U5.VB 13.34,57.15 11.43,59.05 7.62,59.05 v6.99,59.69
  Bottom 0.508: C31.+ 24.61,36.04 22.23,33.66 R42.1 | C31.+ 30.64,36.04 31.11,35.56 32.8,35.56 C32.1 | U1.P$40 35.56,100.33 33.66,102.23 19.05,102.23 17.78,100.97 17.78,95.89 10.79,88.9 8.26,88.9 6.99,87.63 v6.99,59.69 | v31.11,39.37 27.94,39.37 26.67,38.1 C31.+ | U5.VB 22.86,53.98 22.86,49.53 23.5,48.89 28.57,48.89 v29.84,47.62
VCC  (via drill 0.45)
  Top 0.508: LED3.A LED2.A 79.16,74.93 | R35.2 79.16,74.93 | 79.16,74.93 R37.2 R38.2 79.16,82.55 | 79.16,82.55 R39.2 79.16,86.58 78.74,87 v78.74,88.9 | LED1.A 79.16,82.55 | U1.P$18 31.11,95.25 37.47,101.6 52.07,101.6 | U5.5V_1 U5.5V_2 50.8,90.17 52.07,91.44 52.07,101.6 | v48.89,30.48 48.89,32.38 50.8,34.29 v50.8,53.34 74.3,53.34 74.93,53.98 LED4.A | 52.07,101.6 v63.5,101.6
  Top 1.016: v74.93,88.9 v76.83,88.9 v78.74,88.9 v80.64,88.9 v82.55,88.9 83.82,90.17 X1.1
  Bottom 0.508: 74.93,62.86 LED3.A | ULN2.10 65.86,92.47 C29.1 69.85,92.71 71.12,93.98 | v48.89,30.48 R36.1 | U1.P$21 47.84,52.07 C13.1 49.95,52.49 v50.8,53.34 | U1.P$18 24.77,95.25 22.86,97.16 C25.2 | C12.1 v60.96,101.6 v62.23,101.6 v63.5,101.6 65.25,101.6 REG1.3 | LED4.A 74.93,62.86 | R28.2 74.93,62.86
  Bottom 1.016: REG1.3 68.17,101.37 68.58,100.97 68.58,96.52 71.12,93.98 71.75,93.98 72.77,92.97 C26.A 73.03,90.17 74.3,88.9 v74.93,88.9 v76.83,88.9 v78.74,88.9 v80.64,88.9 v82.55,88.9 83.82,90.17 X1.1 X1.2
ZERO_CROSS
  Bottom 0.254: R27.1 65.62,63.28 64.77,64.14 64.77,65.99 Q1.2 62.86,67.89 62.86,70.48 54.61,78.74 44.45,78.74 43.18,80.01 U1.P$32 38.73,80.01 37.47,78.74 20.95,78.74 U5.PC4
ZERO_CROSS_IN
  Bottom 0.254: X1.7 83.82,74.93 80.01,71.12 66.67,71.12 65.87,70.31 Q1.3 65.87,65.41 68.36,62.91 R28.1

### Text on the board
tPlace: LCD | ENC1 | ENC2 | By Rinaldo
bPlace: STM32 - YAXUN 702 | STMF405-V3 | STMF411-V3 | Rev. V3